# EAGLE design KAMERA_ALPHA (EAGLE 8.5.1)
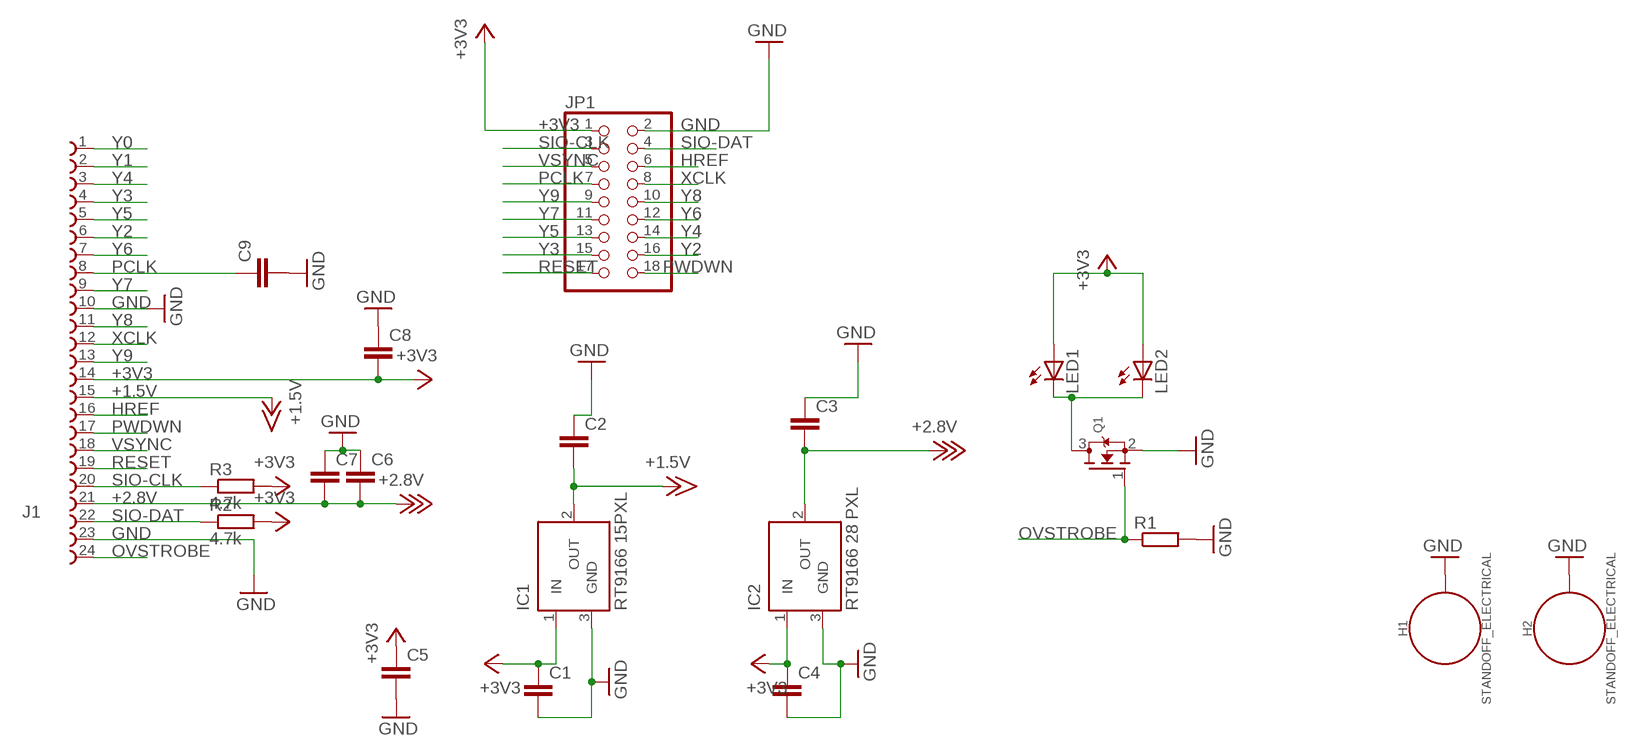
[diagram p0: schematic, sheet 1]

## Parts
C1  C-EUC0805K  [C0805K]
C2  C-EUC0805K  [C0805K]
C3  C-EUC0805K  [C0805K]
C4  C-EUC0805K  [C0805K]
C5  C-EUC0805K  [C0805K]
C6  C-EUC0805K  [C0805K]
C7  C-EUC0805K  [C0805K]
C8  C-EUC0805K  [C0805K]
C9  C-EUC0805K  [C0805K]
H1  STANDOFF_ELECTRICAL  [STANDOFF-ELECTRICAL]
H2  STANDOFF_ELECTRICAL  [STANDOFF-ELECTRICAL]
IC1  RT9166 15PXL  MAX6520  [SOT23]
IC2  RT9166 28 PXL  MAX6520  [SOT23]
J1  68712414022  [68712414022]
JP1  PINHD-2X9  [2X09]
LED1  LEDCHIPLED_0805  [CHIPLED_0805]
LED2  LEDCHIPLED_0805  [CHIPLED_0805]
Q1  MOSFET-NREFLOW  [SOT23]
R1  R-EU_R0805  [R0805]
R2  4.7k  R-EU_R0805  [R0805]
R3  4.7k  R-EU_R0805  [R0805]

## Nets
+1.5V: C2.2 IC1.2(OUT) J1.15
+2.8V: C3.2 C6.2 C7.2 IC2.2(OUT) J1.21
+3V3: C1.1 C4.1 C5.1 C8.2 IC1.1(IN) IC2.1(IN) J1.14 JP1.1 LED1.A LED2.A R2.2 R3.2
GND: C1.2 C2.1 C3.1 C4.2 C5.2 C6.1 C7.1 C8.1 C9.2 H1.P1 H2.P1 IC1.3(GND) IC2.3(GND) J1.10 J1.23 JP1.2 Q1.2(S) R1.2
HREF: J1.16 JP1.6
N$3: LED1.C LED2.C Q1.3(D)
OVSTROBE: J1.24 Q1.1(G) R1.1
PCLK: C9.1 J1.8 JP1.7
PWDWN: J1.17 JP1.18
RESET: J1.19 JP1.17
SIO-CLK: J1.20 JP1.3 R3.1
SIO-DAT: J1.22 JP1.4 R2.1
VSYNC: J1.18 JP1.5
XCLK: J1.12 JP1.8
Y0: J1.1
Y1: J1.2
Y2: J1.6 JP1.16
Y3: J1.4 JP1.15
Y4: J1.3 JP1.14
Y5: J1.5 JP1.13
Y6: J1.7 JP1.12
Y7: J1.9 JP1.11
Y8: J1.11 JP1.10
Y9: J1.13 JP1.9

## Library data of the parts
C1-C9 = resistor:C-EU: CAPACITOR, European symbol
H1 H2 = SparkFun-Hardware:STANDOFF_ELECTRICAL: Stand Off Drill holes with an electrical connection. For example, use these to ground your board to a chassis. Example SparkFun Products Screw - Phillips Head (1/4", 4-40, 10 pack) <https://www.sparkfun.com/products/10453> (PRT-10453) Screw - Phillips Head (1/2", 4-40, 10 pack) <https://www.sparkfun.com/products/10452> (PRT-10452) Screw - Phillips Head (3/4", 4-40, 10 pack) <https://www.sparkfun.com/products/10451> (PRT-10451) Screw - Phillips Head (1", 4-40, 10 pack) <https://www.sparkfun.com/products/10450> (PRT-10450)
IC1 IC2 = maxim:MAX6520: 1.2V Voltage Reference 50ppm/°C, SOT23, 3-Terminal Source: Data sheet <http://datasheets.maxim-ic.com/en/ds/MAX6520.pdf>; MF: MAXIM; MPN: MAX6520EUR-T; OC_FARNELL: unknown; OC_NEWARK: 02J4586
J1 = Wurth_Elektronik_Electromechanic_FPC_Connectors_&_Flat_Flexible_Cable_rev16b:68712414022: WR-FPC 0.5mm SMT ZIF Horizontal Top Contact, 24 Pins=>Code : Con_FPC_ZIF_0.50_68712414022 <http://katalog.we-online.de/media/images/eican/Con_FPC_ZIF_0.50_6871xx14022_pf2.jpg> Details see: http://katalog.we-online.de/en/em/687_1xx_140_22 Created 2014-07-09, Karrer Zheng 2014 (C) Würth Elektronik
JP1 = pinhead:PINHD-2X9: PIN HEADER
LED1 LED2 = adafruit:LED: LED OSRAM: - CHIPLED LG R971, LG N971, LY N971, LG Q971, LY Q971, LO R971, LY R971 LH N974, LH R974 LS Q976, LO Q976, LY Q976 LO Q996 - Hyper CHIPLED LW Q18S LB Q993, LB Q99A, LB R99A - SideLED LS A670, LO A670, LY A670, LG A670, LP A670 LB A673, LV A673, LT A673, LW A673 LH A674 LY A675 LS A676, LA A676, LO A676, LY A676, LW A676 LS A679, LY A679, LG A679 - Hyper Micro SIDELED® LS Y876, LA Y876, LO Y876, LY Y876 LT Y87S - SmartLED LW L88C, LW L88S LB L89C, LB L89S, LG L890 LS L89K, LO L89K, LY L89K LS L896, LA L896, LO L896, LY L896 - TOPLED LS T670, LO T670, LY T670, LG T670, LP T670 LSG T670, LSP T670, LSY T670, LOP T670, LYG T670 LG T671, LOG T671, LSG T671 LB T673, LV T673, LT T673, LW T673 LH T674 LS T676, LA T676, LO T676, LY T676, LB T676, LH T676, LSB T676, LW T676 LB T67C, LV T67C, LT T67C, LS T67K, LO T67K, LY T67K, LW E67C LS E67B, LA E67B, LO E67B, LY E67B, LB E67C, LV E67C, LT E67C LW T67C LS T679, LY T679, LG T679 LS T770, LO T770, LY T770, LG T770, LP T770 LB T773, LV T773, LT T773, LW T773 LH T774 LS E675, LA E675, LY E675, LS T675 LS T776, LA T776, LO T776, LY T776, LB T776 LHGB T686 LT T68C, LB T68C - Hyper Mini TOPLED® LB M676 - Mini TOPLED Santana® LG M470 LS M47K, LO M47K, LY M47K Source: http://www.osram.convergy.de/
Q1 = adafruit:MOSFET-N: N-Channel Mosfet 2N7002E - 60V 260mA SOT23 [Digikey: 2N7002ET1GOSTR-ND] - REEL BSH103 - 30V 850mA SOT23 [Digikey: 568-5013-1-ND]
R1-R3 = resistor:R-EU_: RESISTOR, European symbol

## Board
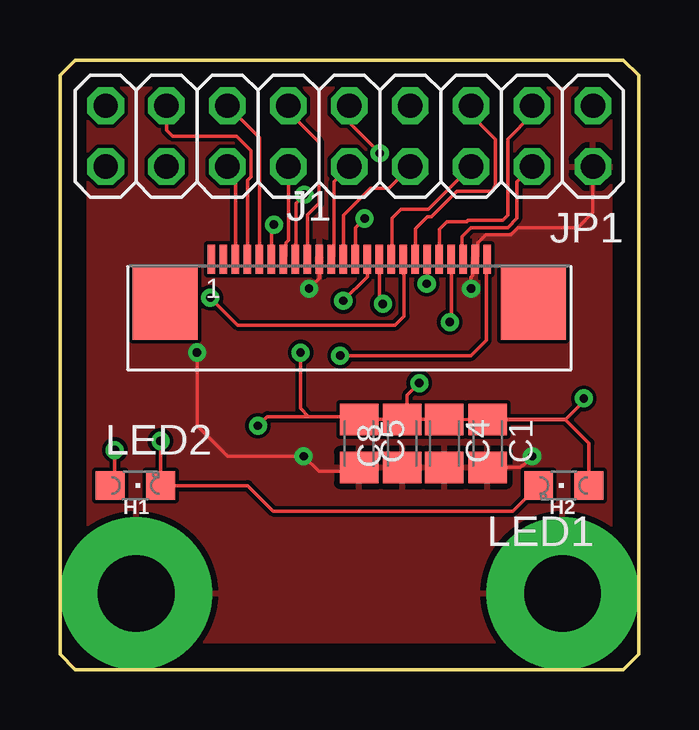
[diagram p1: board, top side]
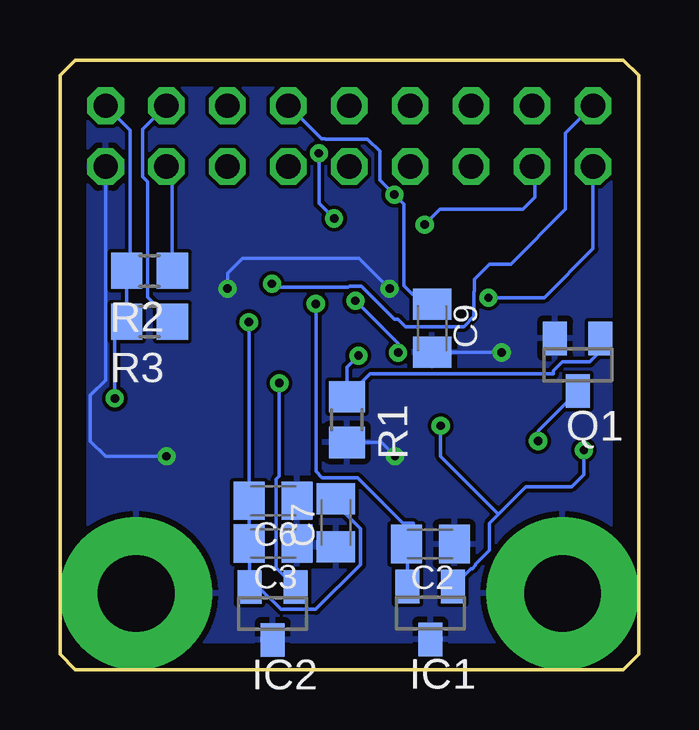
[diagram p2: board, bottom side, seen from below]

Size 24.13 x 25.4 mm. Coordinates in mm from the lower left corner, seen from the top.
Outline: 0,0.63 0.64,0 23.5,0 24.13,0.63 24.13,24.77 23.5,25.4 0.64,25.4 0,24.77 0,0.63
Copper layers (1*16): Top 0.035mm / dielectric 1.5mm / Bottom 0.035mm
Design rules "default": minimum track width 6mil, minimum drill 0.35mm, track to track 6mil, track to pad 6mil, pad to pad 6mil, via to via 6mil, smd to smd 6mil, copper to edge 40mil, drill to drill 6mil, minimum pad ring 10mil, minimum via ring 8mil, stop-mask expansion 4mil, vias tented up to drill 0mil, thermal gap 10mil

### Footprints (pad centres in the part's own frame; a part is rotated, then mirrored left to right if it is on the bottom)
C0805K = smd 1.3 x 1.6: 1 -1,0; 2 1,0
STANDOFF-ELECTRICAL = drill 3.2 pad 6.35: P1 0,0
SOT23 = smd 1 x 1.4: 1 -0.95,-1.1; 2 0.95,-1.1; 3 0,1.1
68712414022 = smd 0.3 x 1.2: 1 -5.75,1.86; 2 -5.25,1.86; 3 -4.75,1.86; 4 -4.25,1.86; 5 -3.75,1.86; 6 -3.25,1.86; 7 -2.75,1.86; 8 -2.25,1.86; 9 -1.75,1.86; 10 -1.25,1.86; 11 -0.75,1.86; 12 -0.25,1.86; 13 0.25,1.86; 14 0.75,1.86; 15 1.25,1.86; 16 1.75,1.86; 17 2.25,1.86; 18 2.75,1.86; 19 3.25,1.86; 20 3.75,1.86; 21 4.25,1.86; 22 4.75,1.86; 23 5.25,1.86; 24 5.75,1.86 | smd 2.7 x 3: Z1 -7.68,0; Z2 7.68,0
2X09 = drill 1.016 octagon: 1 -10.16,-1.27; 2 -10.16,1.27; 3 -7.62,-1.27; 4 -7.62,1.27; 5 -5.08,-1.27; 6 -5.08,1.27; 7 -2.54,-1.27; 8 -2.54,1.27; 9 0,-1.27; 10 0,1.27; 11 2.54,-1.27; 12 2.54,1.27; 13 5.08,-1.27; 14 5.08,1.27; 15 7.62,-1.27; 16 7.62,1.27; 17 10.16,-1.27; 18 10.16,1.27
CHIPLED_0805 = smd 1.2 x 1.2: A 0,-1.05; C 0,1.05
R0805 = smd 1.3 x 1.5: 1 -0.95,0; 2 0.95,0

### Placement (x,y rotation side)
C1  17.83,9.42 270 top
C2  8.69,5.23 180 bottom
C3  15.24,5.26 180 bottom
C4  16.03,9.42 270 top
C5  12.47,9.42 270 top
C6  15.24,7.04 180 bottom
C7  12.62,6.12 90 bottom
C8  14.27,9.42 90 top
C9  8.61,14.22 270 bottom
H1  3.18,3.17 0 top
H2  20.95,3.17 0 top
IC1  8.69,2.36 180 bottom
IC2  15.27,2.34 180 bottom
J1  12.07,15.24 0 top
JP1  12.07,22.23 180 top
LED1  21.01,7.67 90 top
LED2  3.15,7.67 270 top
Q1  2.54,12.7 180 bottom
R1  12.17,10.41 270 bottom
R2  20.4,16.61 180 bottom
R3  20.4,14.5 180 bottom

### Tracks (layer width: path | path; a pad name or v marks a point on that pad's centre or on a via)
+1.5V  (via drill 0.35)
  Top 0.152: J1.15 13.32,15.39 v13.46,15.24
  Bottom 0.152: v13.46,15.24 13.46,8.26 13.21,8 11.73,8 9.83,6.1 9.4,6.1 9.4,5.52 C2.2 | C2.2 | IC1.2 9.64,5.19 C2.2
+2.8V  (via drill 0.35)
  Top 0.152: v16.26,14.48 16.32,14.54 J1.21
  Bottom 0.152: v16.26,14.48 16.24,14.46 C6.2 C3.2 16.22,5.23 IC2.2 15.84,3.44 14.91,2.51 13.46,2.51 11.59,4.38 11.59,5.87 12.62,6.9 C7.2
+3V3  (via drill 0.35)
  Top 0.152: J1.14 12.82,16.37 v11.81,15.37 | v10.03,13.21 10.03,10.88 10.37,10.54 | 10.37,10.54 12.41,10.54 C5.1 C8.2 14.48,10.42 | 14.48,10.42 C4.1 17.66,10.4 | 17.66,10.4 17.83,10.4 C1.1 21.07,10.42 21.08,10.41 | v14.99,11.94 14.48,11.43 14.48,10.42 | v2.29,9.14 2.29,7.86 LED2.A | LED1.A 22.06,9.44 21.08,10.41 | 17.66,10.4 17.67,10.41 21.08,10.41 | v21.84,11.3 21.84,11.18 21.08,10.41 | v8.26,10.16 8.64,10.54 10.37,10.54
  Bottom 0.152: JP1.1 21.21,22.48 21.21,16.75 R2.2 R3.2 21.84,14.01 v21.84,11.3 | v11.81,15.37 10.03,13.59 v10.03,13.21 | IC2.1 15.12,4.24 15.12,7.93 14.99,8.06 v14.99,11.94 | IC1.1 7,4.2 6.94,4.2 6.81,4.34 6.81,4.39 6.22,4.98 6.22,6.1 5.84,6.48 | 5.84,6.48 4.7,7.62 2.79,7.62 2.29,8.13 v2.29,9.14 | 5.84,6.48 8.26,8.89 v8.26,10.16
GND  (via drill 0.35)
  Top 0.152: J1.10 10.82,16.3 v10.39,15.88 | v17.15,15.88 17.15,16.36 17.19,16.41 17.19,16.98 J1.23 17.44,17.22 17.44,17.8 17.75,18.11 18.8,18.11 19.1,18.41 21.59,18.41 22.23,19.05 JP1.2 | v19.69,8.89 19.29,8.5 19.26,8.5 19.19,8.42 C1.2 | C5.2 12.3,8.26 10.8,8.26 v10.16,8.89 6.98,8.89 5.72,10.16 v5.72,13.21
  Bottom 0.152: v10.39,15.88 11.66,17.15 16.51,17.15 17.15,16.51 v17.15,15.88 | JP1.2 22.23,12.06 22.86,11.43 22.86,9.52 22.23,8.89 v19.69,8.89 | R1.2 10.73,9.46 v10.16,8.89 | 8.61,12.62 C9.2 5.73,13.22 v5.72,13.21
  pour Top: 23.5,25.4 24.13,24.77 24.13,0.63 23.5,0 0.64,0 0,0.63 0,24.77 0.64,25.4
  pour Bottom: 0,24.77 0.64,25.4 23.5,25.4 24.13,24.77 24.13,0.63 23.5,0 0.64,0 0,0.63
HREF
  Top 0.152: JP1.6 15.37,19.18 14.22,19.18 13.84,18.8 13.84,17.13 J1.16
N$3  (via drill 0.35)
  Top 0.152: v4.19,9.52 LED2.C 7.82,7.67 8.89,6.6 18.89,6.6 LED1.C
  Bottom 0.152: Q1.3 4.19,9.95 v4.19,9.52
OVSTROBE  (via drill 0.35)
  Top 0.152: v11.68,13.08 17.15,13.08 17.78,13.72 17.78,17.06 J1.24
  Bottom 0.152: Q1.1 1.59,13.27 2.03,12.83 3.18,12.83 3.56,12.45 3.56,12.32 11.21,12.32 R1.1 12.17,12.6 v11.68,13.08
PCLK  (via drill 0.35)
  Top 0.152: J1.8 9.82,17.74 9.83,17.76 9.83,19.44 v10.19,19.79
  Bottom 0.152: JP1.7 13.23,22.12 13.08,22.12 13.06,22.1 11.3,22.1 10.8,21.59 10.8,20.4 v10.19,19.79 9.78,19.38 9.78,16 9,15.22 C9.1
PWDWN  (via drill 0.35)
  Top 0.152: J1.17 14.32,16.51 | 14.32,16.51 14.32,16.47 | v6.27,15.49 7.41,14.35 13.97,14.35 14.35,14.73 14.35,16.47 14.32,16.51
  Bottom 0.152: v6.27,15.49 3.94,15.49 1.91,17.53 JP1.18
RESET  (via drill 0.35)
  Top 0.152: J1.19 15.32,16.1 v15.29,16.08
  Bottom 0.152: JP1.17 3.05,22.35 3.05,19.18 5.33,16.89 6.22,16.89 6.86,16.26 6.86,15.76 6.87,15.74 6.87,14.72 7.3,14.3 9.72,14.3 10.03,14.6 10.19,14.6 11.56,15.97 12.06,15.97 12.11,15.92 15.14,15.92 v15.29,16.08 15.24,16.13
SIO-CLK
  Top 0.152: J1.20 15.82,18.35 16.13,18.67 16.97,18.67 17.02,18.72 18.47,18.72 18.67,18.92 18.67,22.1 19.69,23.11 JP1.3
  Bottom 0.152: R3.1 20.47,15.52 20.47,20.34 20.68,20.55 20.68,22.5 JP1.3
SIO-DAT
  Top 0.152: JP1.4 19.05,20.32 19.05,18.8 18.67,18.41 17.15,18.41 16.76,18.03 16.76,17.15 J1.22
  Bottom 0.152: R2.1 19.45,20.72 JP1.4
VSYNC
  Top 0.152: J1.18 14.82,17.78 14.82,17.95 14.82,18.37 15.32,18.87 15.49,18.87 16.56,19.94 18.03,19.94 18.16,20.19 18.16,22.1 17.15,23.11 JP1.5
XCLK
  Top 0.152: J1.12 11.82,18.93 12.95,20.07 13.72,20.07 JP1.8
Y2  (via drill 0.35)
  Top 0.152: J1.6 8.82,18.44 v8.92,18.54
  Bottom 0.152: v8.92,18.54 8.29,19.18 4.83,19.18 4.32,19.69 4.32,20.83 JP1.16
Y3
  Top 0.152: J1.4 7.82,20.38 7.98,20.55 7.98,21.62 7.37,22.23 4.7,22.23 4.45,22.48 JP1.15
Y4
  Top 0.152: J1.3 7.32,20.62 JP1.14
Y5
  Top 0.152: JP1.13 8.32,22.16 J1.5
Y6
  Top 0.152: JP1.12 9.53,18.8 9.53,18.79 9.53,17.89 9.44,17.8 9.44,17.22 J1.7
Y7
  Top 0.152: J1.9 10.32,18.95 10.8,19.43 10.8,21.97 9.53,23.24 JP1.11
Y8
  Top 0.152: J1.11 11.43,17.21 11.43,20.32 JP1.10
Y9  (via drill 0.35)
  Top 0.152: J1.13 12.32,18.41 v12.7,18.8 | v13.34,21.51 12.07,22.78 JP1.9
  Bottom 0.152: v12.7,18.8 13.34,19.43 v13.34,21.51